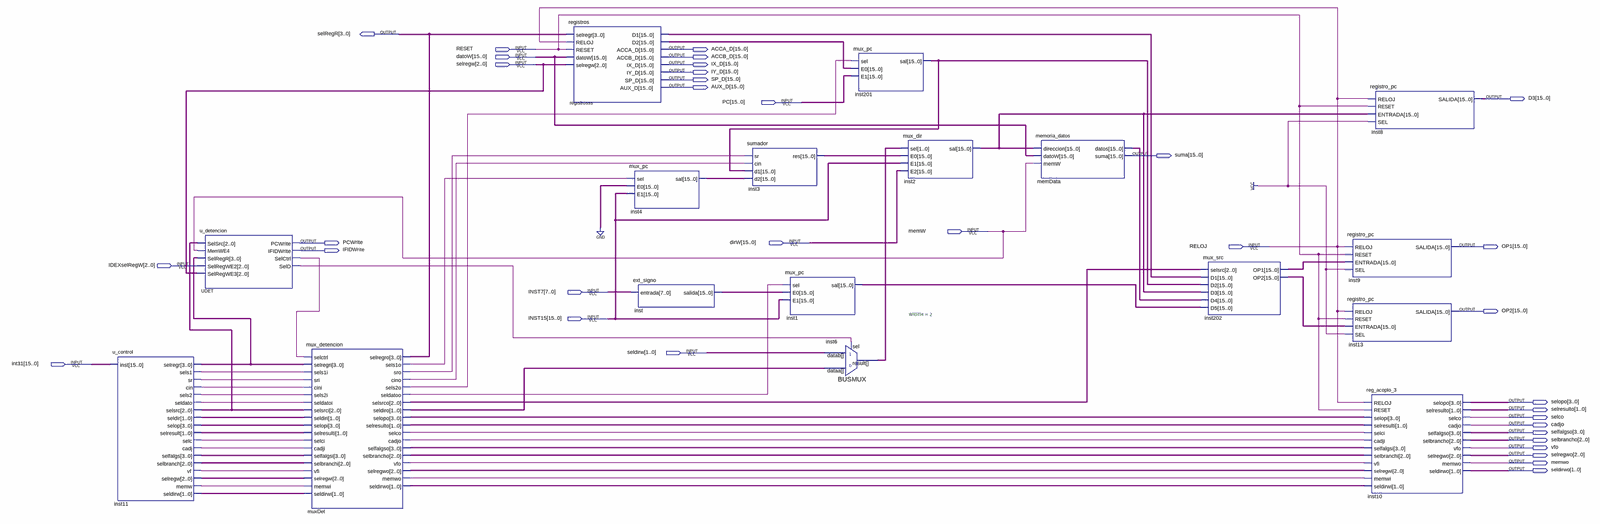
[diagram p0: schematic sheet, whole]
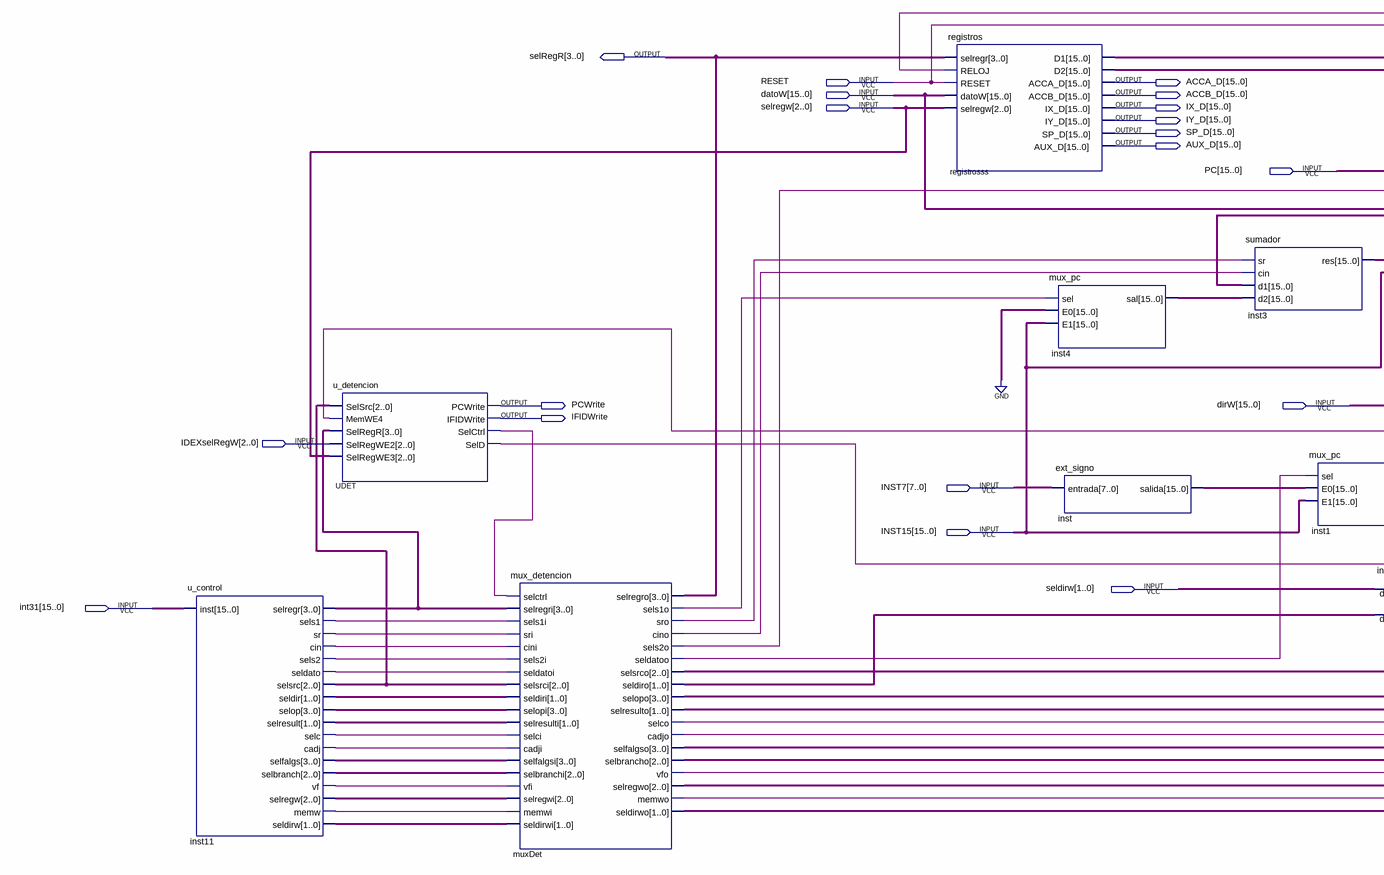
[diagram p1: schematic sheet, left part]
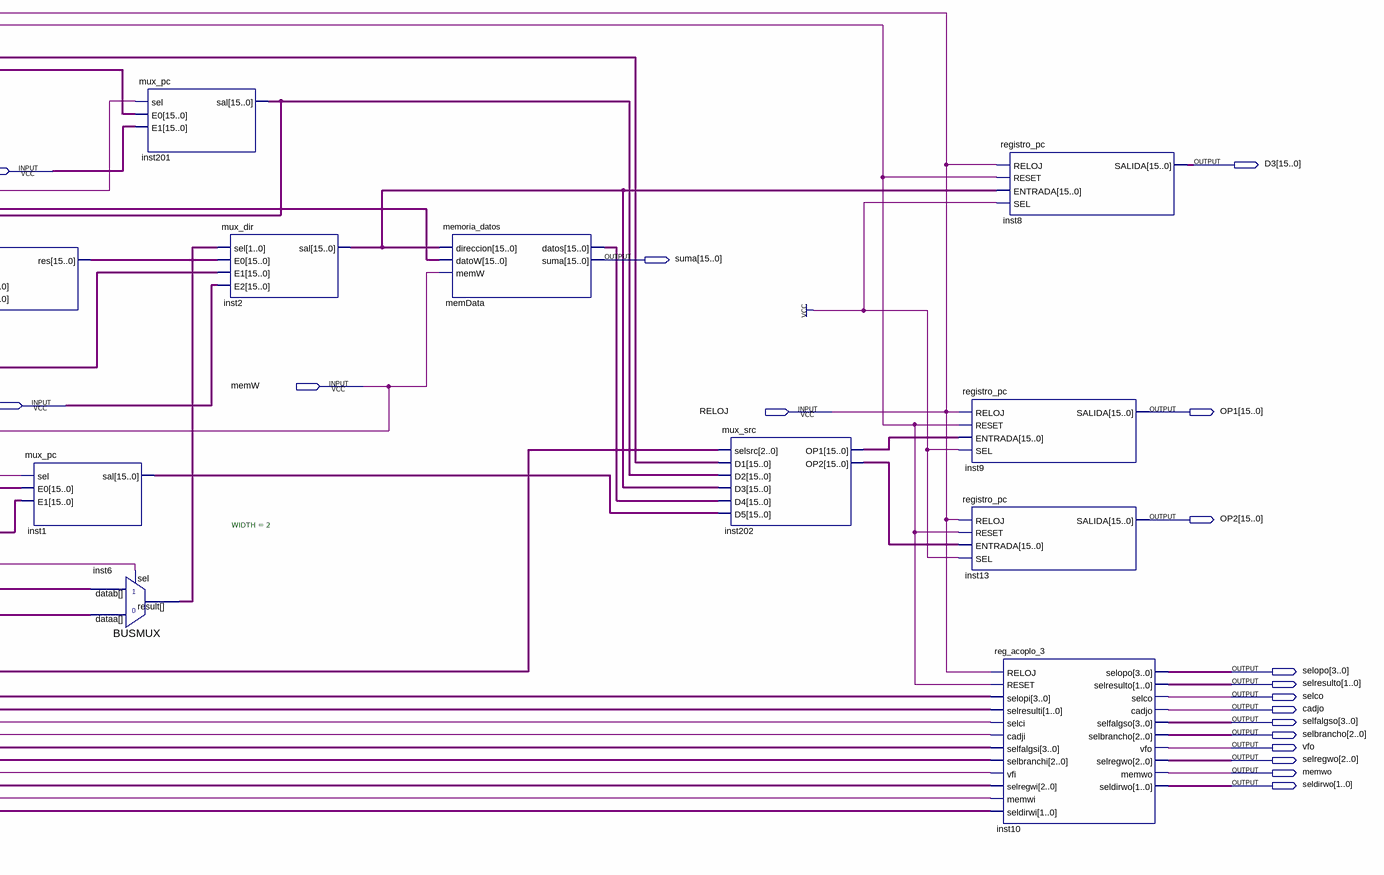
[diagram p2: schematic sheet, right part]
// Quartus schematic etapa2.bdf as structural Verilog: 17 symbols, 35 pins
module etapa2 (
  input  RESET,
  input  [15:0] datoW,
  input  [2:0] selregw,
  input  [15:0] PC,
  input  memW,
  input  [15:0] dirW,
  input  RELOJ,
  input  [2:0] IDEXselRegW,
  input  [7:0] INST7,
  input  [15:0] INST15,
  input  [1:0] seldirw,
  input  [15:0] int31,
  output [3:0] selRegR,
  output [15:0] ACCA_D,
  output [15:0] ACCB_D,
  output [15:0] IX_D,
  output [15:0] IY_D,
  output [15:0] SP_D,
  output [15:0] AUX_D,
  output [15:0] D3,
  output [15:0] suma,
  output PCWrite,
  output [15:0] OP1,
  output IFIDWrite,
  output [15:0] OP2,
  output [3:0] selopo,
  output [1:0] selresulto,
  output selco,
  output cadjo,
  output [3:0] selfalgso,
  output [2:0] selbrancho,
  output vfo,
  output [2:0] selregwo,
  output memwo,
  output [1:0] seldirwo
);

  wire inst11_cadj, inst11_cin, inst11_memw, inst11_selc, inst11_seldato, inst11_sels1, inst11_sels2,
       inst11_sr, inst11_vf, muxDet_cadjo, muxDet_cino, muxDet_memwo, muxDet_selco, muxDet_seldatoo,
       muxDet_sels1o, muxDet_sels2o, muxDet_sro, muxDet_vfo, UDET_selctrl, UDET_seld;
  wire [1:0] inst6_result, inst11_seldir, inst11_seldirw, inst11_selresult, muxDet_seldiro, muxDet_seldirwo,
       muxDet_selresulto;
  wire [2:0] inst11_selbranch, inst11_selregw, inst11_selsrc, muxDet_selbrancho, muxDet_selregwo,
       muxDet_selsrco;
  wire [3:0] inst11_selfalgs, inst11_selop, inst11_selregr, muxDet_selfalgso, muxDet_selopo;
  wire [15:0] inst1_sal, inst2_sal, inst3_res, inst4_sal, inst201_sal, inst202_op1, inst202_op2, inst_salida,
       memData_datos, registrosss_d1, registrosss_d2;

  u_control inst11 (
    .inst(int31), .selregr(inst11_selregr), .sels1(inst11_sels1), .sr(inst11_sr), .cin(inst11_cin),
    .sels2(inst11_sels2), .seldato(inst11_seldato), .selsrc(inst11_selsrc), .seldir(inst11_seldir),
    .selop(inst11_selop), .selresult(inst11_selresult), .selc(inst11_selc), .cadj(inst11_cadj),
    .selfalgs(inst11_selfalgs), .selbranch(inst11_selbranch), .vf(inst11_vf), .selregw(inst11_selregw),
    .memw(inst11_memw), .seldirw(inst11_seldirw));
  u_detencion UDET (
    .SelSrc(inst11_selsrc), .MemWE4(memW), .SelRegR(inst11_selregr), .SelRegWE2(IDEXselRegW),
    .SelRegWE3(selregw), .PCWrite(PCWrite), .IFIDWrite(IFIDWrite), .SelCtrl(UDET_selctrl), .SelD(UDET_seld));
  mux_detencion muxDet (
    .selctrl(UDET_selctrl), .selregri(inst11_selregr), .sels1i(inst11_sels1), .sri(inst11_sr),
    .cini(inst11_cin), .sels2i(inst11_sels2), .seldatoi(inst11_seldato), .selsrci(inst11_selsrc),
    .seldiri(inst11_seldir), .selopi(inst11_selop), .selresulti(inst11_selresult), .selci(inst11_selc),
    .cadji(inst11_cadj), .selfalgsi(inst11_selfalgs), .selbranchi(inst11_selbranch), .vfi(inst11_vf),
    .selregwi(inst11_selregw), .memwi(inst11_memw), .seldirwi(inst11_seldirw), .selregro(selRegR),
    .sels1o(muxDet_sels1o), .sro(muxDet_sro), .cino(muxDet_cino), .sels2o(muxDet_sels2o),
    .seldatoo(muxDet_seldatoo), .selsrco(muxDet_selsrco), .seldiro(muxDet_seldiro), .selopo(muxDet_selopo),
    .selresulto(muxDet_selresulto), .selco(muxDet_selco), .cadjo(muxDet_cadjo), .selfalgso(muxDet_selfalgso),
    .selbrancho(muxDet_selbrancho), .vfo(muxDet_vfo), .selregwo(muxDet_selregwo), .memwo(muxDet_memwo),
    .seldirwo(muxDet_seldirwo));
  registros registrosss (
    .selregr(selRegR), .RELOJ(RELOJ), .RESET(RESET), .datoW(datoW), .selregw(selregw), .D1(registrosss_d1),
    .D2(registrosss_d2), .ACCA_D(ACCA_D), .ACCB_D(ACCB_D), .IX_D(IX_D), .IY_D(IY_D), .SP_D(SP_D),
    .AUX_D(AUX_D));
  mux_pc inst4 (.sel(muxDet_sels1o), .E0({16{1'b0}}), .E1(INST15), .sal(inst4_sal));
  ext_signo inst (.entrada(INST7), .salida(inst_salida));
  sumador inst3 (.sr(muxDet_sro), .cin(muxDet_cino), .d1(inst201_sal), .d2(inst4_sal), .res(inst3_res));
  mux_pc inst1 (.sel(muxDet_seldatoo), .E0(inst_salida), .E1(INST15), .sal(inst1_sal));
  BUSMUX #(.WIDTH(2)) inst6 (.datab(seldirw), .sel(UDET_seld), .dataa(muxDet_seldiro), .result(inst6_result));
  mux_pc inst201 (.sel(muxDet_sels2o), .E0(registrosss_d2), .E1(PC), .sal(inst201_sal));
  mux_dir inst2 (.sel(inst6_result), .E0(inst3_res), .E1(INST15), .E2(dirW), .sal(inst2_sal));
  memoria_datos memData (.direccion(inst2_sal), .datoW(datoW), .memW(memW), .datos(memData_datos), .suma(suma));
  mux_src inst202 (
    .selsrc(muxDet_selsrco), .D1(registrosss_d1), .D2(inst201_sal), .D3(inst2_sal), .D4(memData_datos),
    .D5(inst1_sal), .OP1(inst202_op1), .OP2(inst202_op2));
  registro_pc inst9 (.RELOJ(RELOJ), .RESET(RESET), .SEL(1'b1), .ENTRADA(inst202_op1), .SALIDA(OP1));
  registro_pc inst13 (.RELOJ(RELOJ), .RESET(RESET), .SEL(1'b1), .ENTRADA(inst202_op2), .SALIDA(OP2));
  registro_pc inst8 (.RELOJ(RELOJ), .RESET(RESET), .SEL(1'b1), .ENTRADA(inst2_sal), .SALIDA(D3));
  reg_acoplo_3 inst10 (
    .RELOJ(RELOJ), .RESET(RESET), .selopi(muxDet_selopo), .selresulti(muxDet_selresulto),
    .selci(muxDet_selco), .cadji(muxDet_cadjo), .selfalgsi(muxDet_selfalgso), .selbranchi(muxDet_selbrancho),
    .vfi(muxDet_vfo), .selregwi(muxDet_selregwo), .memwi(muxDet_memwo), .seldirwi(muxDet_seldirwo),
    .selopo(selopo), .selresulto(selresulto), .selco(selco), .cadjo(cadjo), .selfalgso(selfalgso),
    .selbrancho(selbrancho), .vfo(vfo), .selregwo(selregwo), .memwo(memwo), .seldirwo(seldirwo));
endmodule
